# Altium project iMX6 Rex_V1I1.PrjPcb
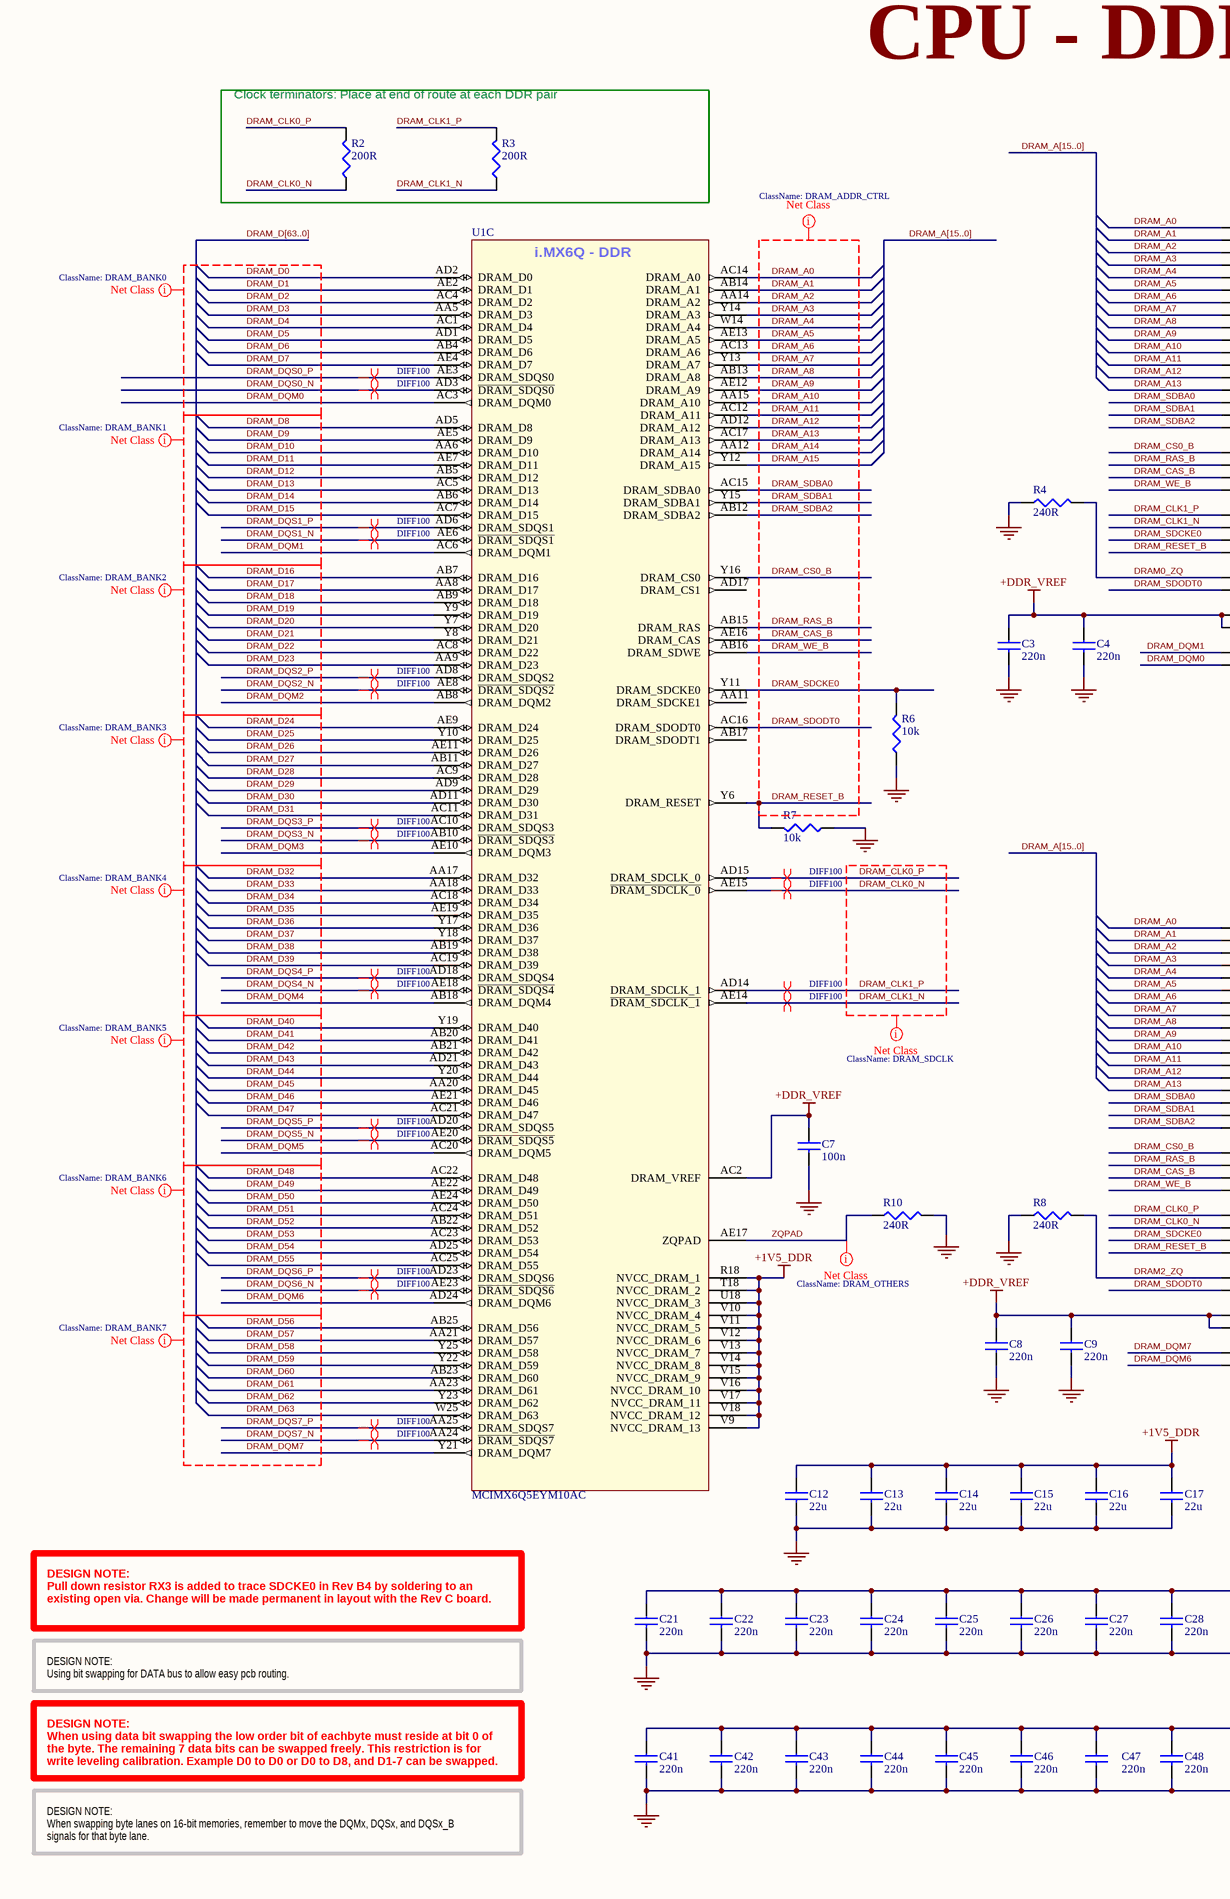
[diagram p0: [04] - CPU - DDR3, DDR3 MEM.SchDoc, left]
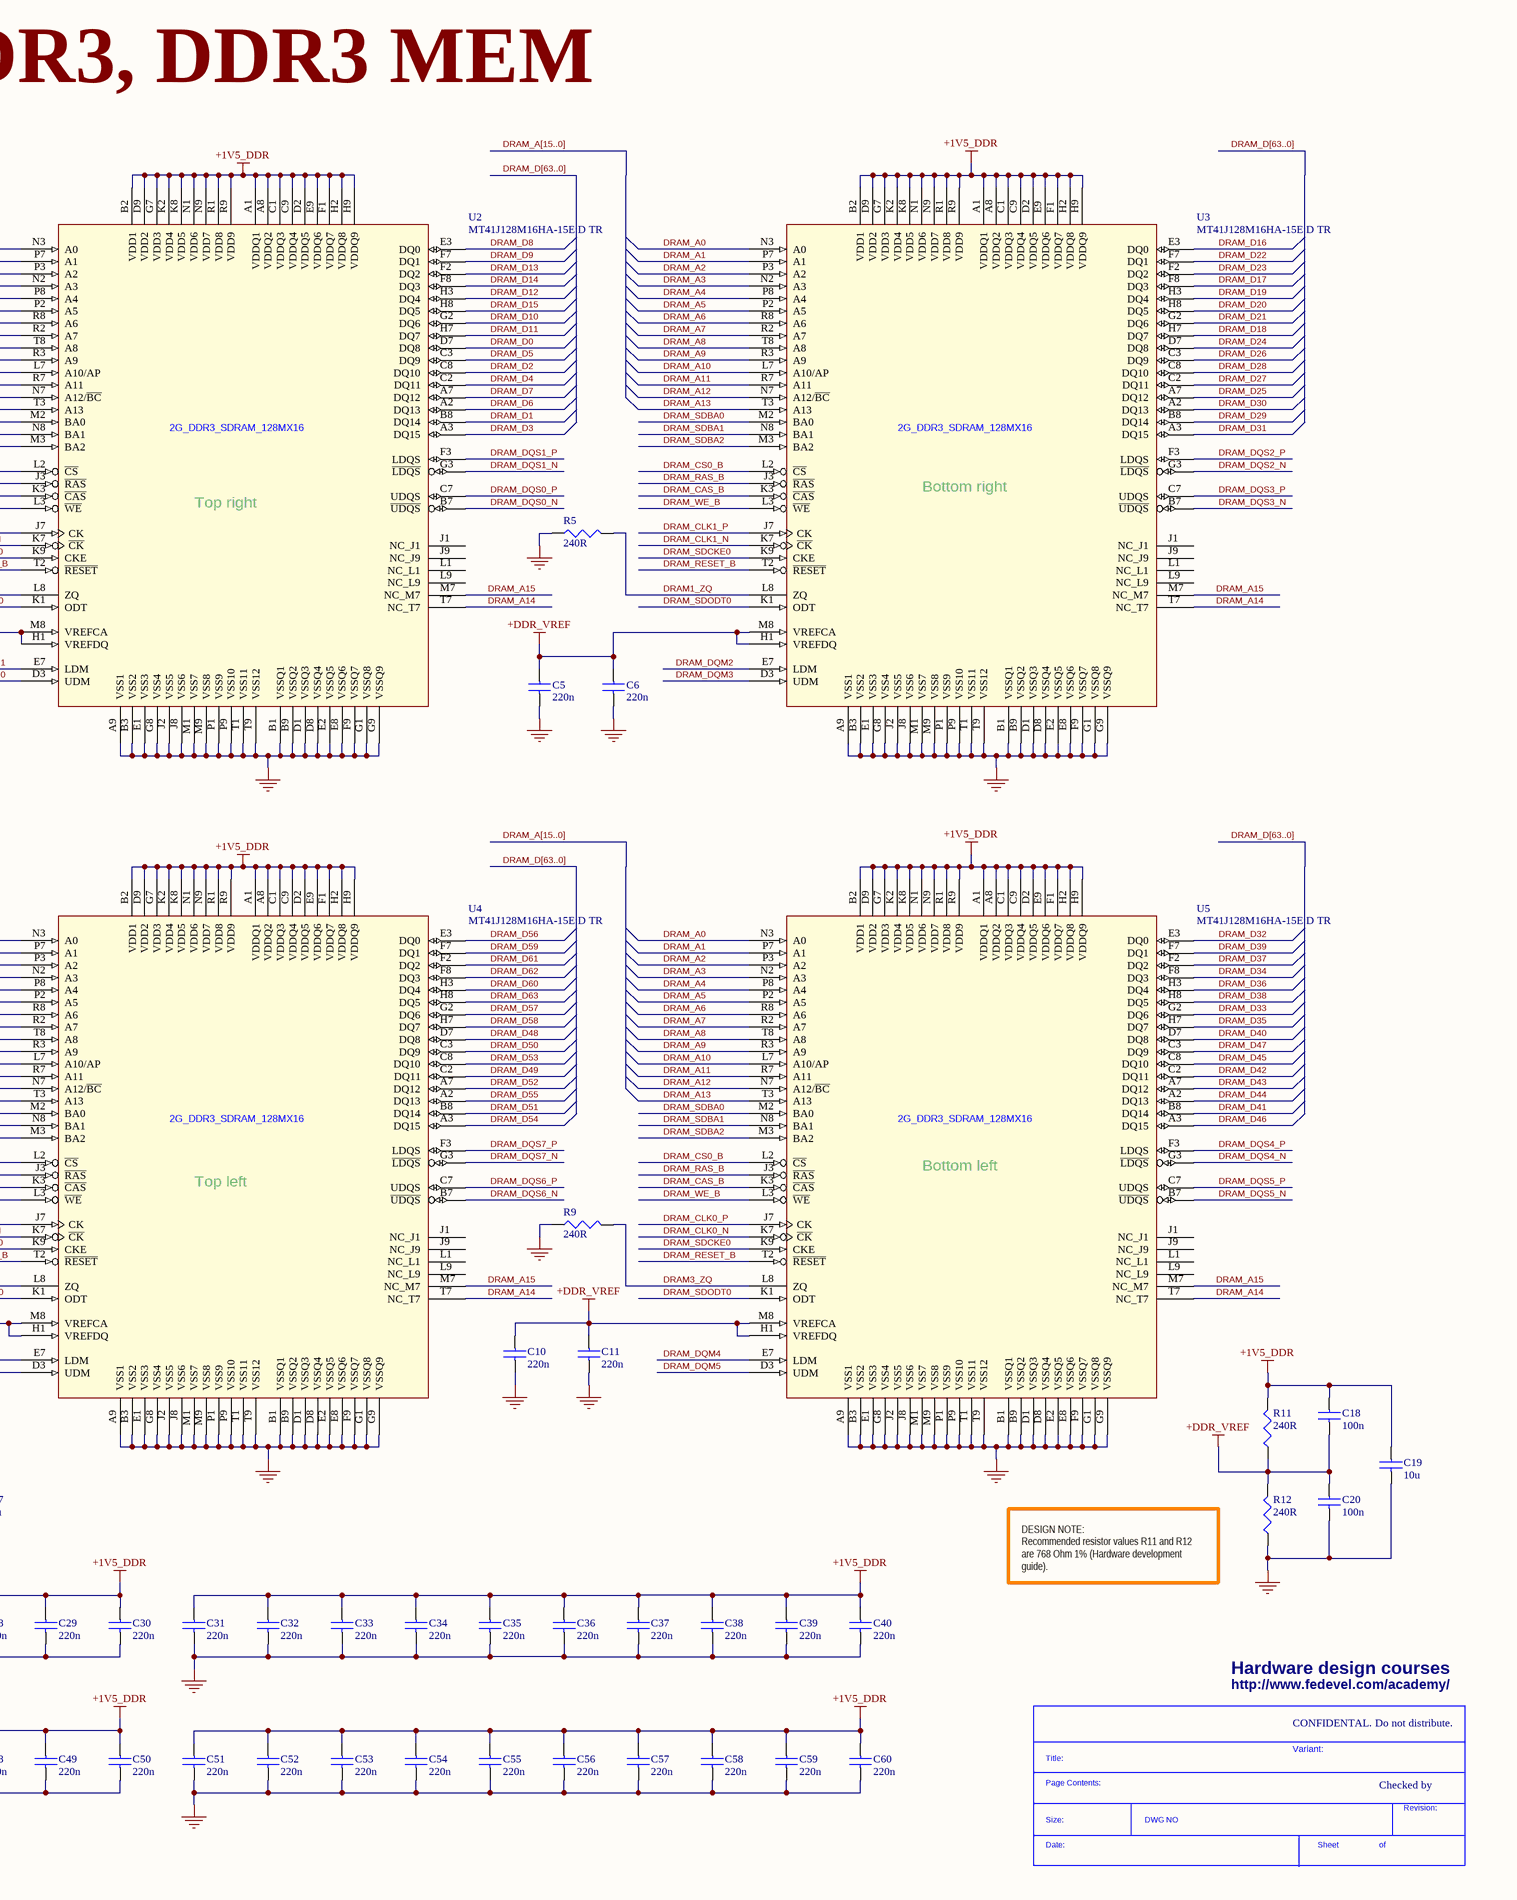
[diagram p1: [04] - CPU - DDR3, DDR3 MEM.SchDoc, right]
ClientCompanyName: FEDEVEL Academy; ClientContactEmail: robert.feranec@fedevel.com; ClientContactName: Robert Feranec; ClientWebsite: http://www.fedevel.com/academy/; Company: (c) 2013 FEDEVEL www.fedevel.com; Project: iMX6 Rex Module; VersionRevision: V1I1
2 sheets, 169 parts. Net scope: global (net labels, ports and power ports of the same name join across sheets).
Board file: iMX6 Rex_V1I1_PCB.PcbDoc
Sheets:
  [04] - CPU - DDR3, DDR3 MEM.SchDoc
  [11] - CPU - POWER.SchDoc

## Sheet [04] - CPU - DDR3, DDR3 MEM.SchDoc
size A2; DocumentNumber: 4; SheetNumber: 4; SheetTotal: 20

### Parts
(Parts that share a designator on the sheet are numbered #1, #2 ... from top to bottom, then left to right.)
*#1  SDTitleBlock  (value not drawn)  (graphical)
C3  220n  [C0402]
C4  220n  [C0402]
C5  220n  [C0402]
C6  220n  [C0402]
C7  100n  [C0402]
C8  220n  [C0402]
C9  220n  [C0402]
C10  220n  [C0402]
C11  220n  [C0402]
C12  22u  [C0603]
C13  22u  [C0603]
C14  22u  [C0603]
C15  22u  [C0603]
C16  22u  [C0603]
C17  22u  [C0603]
C18  100n  [C0402]
C19  10u  [C0603]
C20  100n  [C0402]
C21  220n  [C0402]
C22  220n  [C0402]
C23  220n  [C0402]
C24  220n  [C0402]
C25  220n  [C0402]
C26  220n  [C0402]
C27  220n  [C0402]
C28  220n  [C0402]
C29  220n  [C0402]
C30  220n  [C0402]
C31  220n  [C0402]
C32  220n  [C0402]
C33  220n  [C0402]
C34  220n  [C0402]
C35  220n  [C0402]
C36  220n  [C0402]
C37  220n  [C0402]
C38  220n  [C0402]
C39  220n  [C0402]
C40  220n  [C0402]
C41  220n  [C0402]
C42  220n  [C0402]
C43  220n  [C0402]
C44  220n  [C0402]
C45  220n  [C0402]
C46  220n  [C0402]
C47  220n  [C0402]
C48  220n  [C0402]
C49  220n  [C0402]
C50  220n  [C0402]
C51  220n  [C0402]
C52  220n  [C0402]
C53  220n  [C0402]
C54  220n  [C0402]
C55  220n  [C0402]
C56  220n  [C0402]
C57  220n  [C0402]
C58  220n  [C0402]
C59  220n  [C0402]
C60  220n  [C0402]
R2  200R  [R0402]
R3  200R  [R0402]
R4  240R  [R0402]
R5  240R  [R0402]
R6  10k  [R0402]
R7  10k  [R0402]
R8  240R  [R0402]
R9  240R  [R0402]
R10  240R  [R0402]
R11  240R  [R0402]
R12  240R  [R0402]
U1  MCIMX6Q5EYM10AC  [PBGA624]  (part C of 15)
U2  MT41J128M16HA-15E:D TR  [96_FPGA_DD3]
U3  MT41J128M16HA-15E:D TR  [96_FPGA_DD3]
U4  MT41J128M16HA-15E:D TR  [96_FPGA_DD3]
U5  MT41J128M16HA-15E:D TR  [96_FPGA_DD3]

### Blocks framed on the sheet
Clock terminators: Place at end of route at each DDR pair: R2 R3

### Nets
+1V5_DDR: C12.1 C13.1 C14.1 C15.1 C16.1 C17.1 C18.1 C19.1 C21.1 C22.1 C23.1 C24.1 C25.1 C26.1 C27.1 C28.1 C29.1 C30.1 C31.1 C32.1 C33.1 C34.1 C35.1 C36.1 C37.1 C38.1 C39.1 C40.1 C41.1 C42.1 C43.1 C44.1 C45.1 C46.1 C47.1 C48.1 C49.1 C50.1 C51.1 C52.1 C53.1 C54.1 C55.1 C56.1 C57.1 C58.1 C59.1 C60.1 R11.2 U1.R18(NVCC_DRAM_1) U1.T18(NVCC_DRAM_2) U1.U18(NVCC_DRAM_3) U1.V9(NVCC_DRAM_13) U1.V10(NVCC_DRAM_4) U1.V11(NVCC_DRAM_5) U1.V12(NVCC_DRAM_6) U1.V13(NVCC_DRAM_7) U1.V14(NVCC_DRAM_8) U1.V15(NVCC_DRAM_9) U1.V16(NVCC_DRAM_10) U1.V17(NVCC_DRAM_11) U1.V18(NVCC_DRAM_12) U2.A1(VDDQ1) U2.A8(VDDQ2) U2.B2(VDD1) U2.C1(VDDQ3) U2.C9(VDDQ4) U2.D2(VDDQ5) U2.D9(VDD2) U2.E9(VDDQ6) U2.F1(VDDQ7) U2.G7(VDD3) U2.H2(VDDQ8) U2.H9(VDDQ9) U2.K2(VDD4) U2.K8(VDD5) U2.N1(VDD6) U2.N9(VDD7) U2.R1(VDD8) U2.R9(VDD9) U3.A1(VDDQ1) U3.A8(VDDQ2) U3.B2(VDD1) U3.C1(VDDQ3) U3.C9(VDDQ4) U3.D2(VDDQ5) U3.D9(VDD2) U3.E9(VDDQ6) U3.F1(VDDQ7) U3.G7(VDD3) U3.H2(VDDQ8) U3.H9(VDDQ9) U3.K2(VDD4) U3.K8(VDD5) U3.N1(VDD6) U3.N9(VDD7) U3.R1(VDD8) U3.R9(VDD9) U4.A1(VDDQ1) U4.A8(VDDQ2) U4.B2(VDD1) U4.C1(VDDQ3) U4.C9(VDDQ4) U4.D2(VDDQ5) U4.D9(VDD2) U4.E9(VDDQ6) U4.F1(VDDQ7) U4.G7(VDD3) U4.H2(VDDQ8) U4.H9(VDDQ9) U4.K2(VDD4) U4.K8(VDD5) U4.N1(VDD6) U4.N9(VDD7) U4.R1(VDD8) U4.R9(VDD9) U5.A1(VDDQ1) U5.A8(VDDQ2) U5.B2(VDD1) U5.C1(VDDQ3) U5.C9(VDDQ4) U5.D2(VDDQ5) U5.D9(VDD2) U5.E9(VDDQ6) U5.F1(VDDQ7) U5.G7(VDD3) U5.H2(VDDQ8) U5.H9(VDDQ9) U5.K2(VDD4) U5.K8(VDD5) U5.N1(VDD6) U5.N9(VDD7) U5.R1(VDD8) U5.R9(VDD9)
+DDR_VREF: C3.1 C4.1 C5.1 C6.1 C7.1 C8.1 C9.1 C10.1 C11.1 C18.2 C20.1 R11.1 R12.2 U1.AC2(DRAM_VREF) U2.H1(VREFDQ) U2.M8(VREFCA) U3.H1(VREFDQ) U3.M8(VREFCA) U4.H1(VREFDQ) U4.M8(VREFCA) U5.H1(VREFDQ) U5.M8(VREFCA)
GND: C3.2 C4.2 C5.2 C6.2 C7.2 C8.2 C9.2 C10.2 C11.2 C12.2 C13.2 C14.2 C15.2 C16.2 C17.2 C19.2 C20.2 C21.2 C22.2 C23.2 C24.2 C25.2 C26.2 C27.2 C28.2 C29.2 C30.2 C31.2 C32.2 C33.2 C34.2 C35.2 C36.2 C37.2 C38.2 C39.2 C40.2 C41.2 C42.2 C43.2 C44.2 C45.2 C46.2 C47.2 C48.2 C49.2 C50.2 C51.2 C52.2 C53.2 C54.2 C55.2 C56.2 C57.2 C58.2 C59.2 C60.2 R4.1 R5.1 R6.1 R7.1 R8.1 R9.1 R10.2 R12.1 U2.A9(VSS1) U2.B1(VSSQ1) U2.B3(VSS2) U2.B9(VSSQ2) U2.D1(VSSQ3) U2.D8(VSSQ4) U2.E1(VSS3) U2.E2(VSSQ5) U2.E8(VSSQ6) U2.F9(VSSQ7) U2.G1(VSSQ8) U2.G8(VSS4) U2.G9(VSSQ9) U2.J2(VSS5) U2.J8(VSS6) U2.M1(VSS7) U2.M9(VSS8) U2.P1(VSS9) U2.P9(VSS10) U2.T1(VSS11) U2.T9(VSS12) U3.A9(VSS1) U3.B1(VSSQ1) U3.B3(VSS2) U3.B9(VSSQ2) U3.D1(VSSQ3) U3.D8(VSSQ4) U3.E1(VSS3) U3.E2(VSSQ5) U3.E8(VSSQ6) U3.F9(VSSQ7) U3.G1(VSSQ8) U3.G8(VSS4) U3.G9(VSSQ9) U3.J2(VSS5) U3.J8(VSS6) U3.M1(VSS7) U3.M9(VSS8) U3.P1(VSS9) U3.P9(VSS10) U3.T1(VSS11) U3.T9(VSS12) U4.A9(VSS1) U4.B1(VSSQ1) U4.B3(VSS2) U4.B9(VSSQ2) U4.D1(VSSQ3) U4.D8(VSSQ4) U4.E1(VSS3) U4.E2(VSSQ5) U4.E8(VSSQ6) U4.F9(VSSQ7) U4.G1(VSSQ8) U4.G8(VSS4) U4.G9(VSSQ9) U4.J2(VSS5) U4.J8(VSS6) U4.M1(VSS7) U4.M9(VSS8) U4.P1(VSS9) U4.P9(VSS10) U4.T1(VSS11) U4.T9(VSS12) U5.A9(VSS1) U5.B1(VSSQ1) U5.B3(VSS2) U5.B9(VSSQ2) U5.D1(VSSQ3) U5.D8(VSSQ4) U5.E1(VSS3) U5.E2(VSSQ5) U5.E8(VSSQ6) U5.F9(VSSQ7) U5.G1(VSSQ8) U5.G8(VSS4) U5.G9(VSSQ9) U5.J2(VSS5) U5.J8(VSS6) U5.M1(VSS7) U5.M9(VSS8) U5.P1(VSS9) U5.P9(VSS10) U5.T1(VSS11) U5.T9(VSS12)
DRAM0_ZQ: R4.2 U2.L8(ZQ)
DRAM1_ZQ: R5.2 U3.L8(ZQ)
DRAM2_ZQ: R8.2 U4.L8(ZQ)
DRAM3_ZQ: R9.2 U5.L8(ZQ)
DRAM_A0: U1.AC14(DRAM_A0) U2.N3(A0) U3.N3(A0) U4.N3(A0) U5.N3(A0)
DRAM_A1: U1.AB14(DRAM_A1) U2.P7(A1) U3.P7(A1) U4.P7(A1) U5.P7(A1)
DRAM_A2: U1.AA14(DRAM_A2) U2.P3(A2) U3.P3(A2) U4.P3(A2) U5.P3(A2)
DRAM_A3: U1.Y14(DRAM_A3) U2.N2(A3) U3.N2(A3) U4.N2(A3) U5.N2(A3)
DRAM_A4: U1.W14(DRAM_A4) U2.P8(A4) U3.P8(A4) U4.P8(A4) U5.P8(A4)
DRAM_A5: U1.AE13(DRAM_A5) U2.P2(A5) U3.P2(A5) U4.P2(A5) U5.P2(A5)
DRAM_A6: U1.AC13(DRAM_A6) U2.R8(A6) U3.R8(A6) U4.R8(A6) U5.R8(A6)
DRAM_A7: U1.Y13(DRAM_A7) U2.R2(A7) U3.R2(A7) U4.R2(A7) U5.R2(A7)
DRAM_A8: U1.AB13(DRAM_A8) U2.T8(A8) U3.T8(A8) U4.T8(A8) U5.T8(A8)
DRAM_A9: U1.AE12(DRAM_A9) U2.R3(A9) U3.R3(A9) U4.R3(A9) U5.R3(A9)
DRAM_A10: U1.AA15(DRAM_A10) U2.L7(A10/AP) U3.L7(A10/AP) U4.L7(A10/AP) U5.L7(A10/AP)
DRAM_A11: U1.AC12(DRAM_A11) U2.R7(A11) U3.R7(A11) U4.R7(A11) U5.R7(A11)
DRAM_A12: U1.AD12(DRAM_A12) U2.N7(A12/~{BC}) U3.N7(A12/~{BC}) U4.N7(A12/~{BC}) U5.N7(A12/~{BC})
DRAM_A13: U1.AC17(DRAM_A13) U2.T3(A13) U3.T3(A13) U4.T3(A13) U5.T3(A13)
DRAM_A14: U1.AA12(DRAM_A14) U2.T7(NC_T7) U3.T7(NC_T7) U4.T7(NC_T7) U5.T7(NC_T7)
DRAM_A15: U1.Y12(DRAM_A15) U2.M7(NC_M7) U3.M7(NC_M7) U4.M7(NC_M7) U5.M7(NC_M7)
DRAM_CAS_B: U1.AE16(DRAM_CAS) U2.K3(~{CAS}) U3.K3(~{CAS}) U4.K3(~{CAS}) U5.K3(~{CAS})
DRAM_CLK0_N: R2.1 U1.AE15(~{DRAM_SDCLK_0}) U4.K7(~{CK}) U5.K7(~{CK})
DRAM_CLK0_P: R2.2 U1.AD15(DRAM_SDCLK_0) U4.J7(CK) U5.J7(CK)
DRAM_CLK1_N: R3.1 U1.AE14(~{DRAM_SDCLK_1}) U2.K7(~{CK}) U3.K7(~{CK})
DRAM_CLK1_P: R3.2 U1.AD14(DRAM_SDCLK_1) U2.J7(CK) U3.J7(CK)
DRAM_CS0_B: U1.Y16(DRAM_CS0) U2.L2(~{CS}) U3.L2(~{CS}) U4.L2(~{CS}) U5.L2(~{CS})
DRAM_D0: U1.AD2(DRAM_D0) U2.D7(DQ8)
DRAM_D1: U1.AE2(DRAM_D1) U2.B8(DQ14)
DRAM_D2: U1.AC4(DRAM_D2) U2.C8(DQ10)
DRAM_D3: U1.AA5(DRAM_D3) U2.A3(DQ15)
DRAM_D4: U1.AC1(DRAM_D4) U2.C2(DQ11)
DRAM_D5: U1.AD1(DRAM_D5) U2.C3(DQ9)
DRAM_D6: U1.AB4(DRAM_D6) U2.A2(DQ13)
DRAM_D7: U1.AE4(DRAM_D7) U2.A7(DQ12)
DRAM_D8: U1.AD5(DRAM_D8) U2.E3(DQ0)
DRAM_D9: U1.AE5(DRAM_D9) U2.F7(DQ1)
DRAM_D10: U1.AA6(DRAM_D10) U2.G2(DQ6)
DRAM_D11: U1.AE7(DRAM_D11) U2.H7(DQ7)
DRAM_D12: U1.AB5(DRAM_D12) U2.H3(DQ4)
DRAM_D13: U1.AC5(DRAM_D13) U2.F2(DQ2)
DRAM_D14: U1.AB6(DRAM_D14) U2.F8(DQ3)
DRAM_D15: U1.AC7(DRAM_D15) U2.H8(DQ5)
DRAM_D16: U1.AB7(DRAM_D16) U3.E3(DQ0)
DRAM_D17: U1.AA8(DRAM_D17) U3.F8(DQ3)
DRAM_D18: U1.AB9(DRAM_D18) U3.H7(DQ7)
DRAM_D19: U1.Y9(DRAM_D19) U3.H3(DQ4)
DRAM_D20: U1.Y7(DRAM_D20) U3.H8(DQ5)
DRAM_D21: U1.Y8(DRAM_D21) U3.G2(DQ6)
DRAM_D22: U1.AC8(DRAM_D22) U3.F7(DQ1)
DRAM_D23: U1.AA9(DRAM_D23) U3.F2(DQ2)
DRAM_D24: U1.AE9(DRAM_D24) U3.D7(DQ8)
DRAM_D25: U1.Y10(DRAM_D25) U3.A7(DQ12)
DRAM_D26: U1.AE11(DRAM_D26) U3.C3(DQ9)
DRAM_D27: U1.AB11(DRAM_D27) U3.C2(DQ11)
DRAM_D28: U1.AC9(DRAM_D28) U3.C8(DQ10)
DRAM_D29: U1.AD9(DRAM_D29) U3.B8(DQ14)
DRAM_D30: U1.AD11(DRAM_D30) U3.A2(DQ13)
DRAM_D31: U1.AC11(DRAM_D31) U3.A3(DQ15)
DRAM_D32: U1.AA17(DRAM_D32) U5.E3(DQ0)
DRAM_D33: U1.AA18(DRAM_D33) U5.G2(DQ6)
DRAM_D34: U1.AC18(DRAM_D34) U5.F8(DQ3)
DRAM_D35: U1.AE19(DRAM_D35) U5.H7(DQ7)
DRAM_D36: U1.Y17(DRAM_D36) U5.H3(DQ4)
DRAM_D37: U1.Y18(DRAM_D37) U5.F2(DQ2)
DRAM_D38: U1.AB19(DRAM_D38) U5.H8(DQ5)
DRAM_D39: U1.AC19(DRAM_D39) U5.F7(DQ1)
DRAM_D40: U1.Y19(DRAM_D40) U5.D7(DQ8)
DRAM_D41: U1.AB20(DRAM_D41) U5.B8(DQ14)
DRAM_D42: U1.AB21(DRAM_D42) U5.C2(DQ11)
DRAM_D43: U1.AD21(DRAM_D43) U5.A7(DQ12)
DRAM_D44: U1.Y20(DRAM_D44) U5.A2(DQ13)
DRAM_D45: U1.AA20(DRAM_D45) U5.C8(DQ10)
DRAM_D46: U1.AE21(DRAM_D46) U5.A3(DQ15)
DRAM_D47: U1.AC21(DRAM_D47) U5.C3(DQ9)
DRAM_D48: U1.AC22(DRAM_D48) U4.D7(DQ8)
DRAM_D49: U1.AE22(DRAM_D49) U4.C2(DQ11)
DRAM_D50: U1.AE24(DRAM_D50) U4.C3(DQ9)
DRAM_D51: U1.AC24(DRAM_D51) U4.B8(DQ14)
DRAM_D52: U1.AB22(DRAM_D52) U4.A7(DQ12)
DRAM_D53: U1.AC23(DRAM_D53) U4.C8(DQ10)
DRAM_D54: U1.AD25(DRAM_D54) U4.A3(DQ15)
DRAM_D55: U1.AC25(DRAM_D55) U4.A2(DQ13)
DRAM_D56: U1.AB25(DRAM_D56) U4.E3(DQ0)
DRAM_D57: U1.AA21(DRAM_D57) U4.G2(DQ6)
DRAM_D58: U1.Y25(DRAM_D58) U4.H7(DQ7)
DRAM_D59: U1.Y22(DRAM_D59) U4.F7(DQ1)
DRAM_D60: U1.AB23(DRAM_D60) U4.H3(DQ4)
DRAM_D61: U1.AA23(DRAM_D61) U4.F2(DQ2)
DRAM_D62: U1.Y23(DRAM_D62) U4.F8(DQ3)
DRAM_D63: U1.W25(DRAM_D63) U4.H8(DQ5)
DRAM_DQM0: U1.AC3(DRAM_DQM0) U2.D3(UDM)
DRAM_DQM1: U1.AC6(DRAM_DQM1) U2.E7(LDM)
DRAM_DQM2: U1.AB8(DRAM_DQM2) U3.E7(LDM)
DRAM_DQM3: U1.AE10(DRAM_DQM3) U3.D3(UDM)
DRAM_DQM4: U1.AB18(DRAM_DQM4) U5.E7(LDM)
DRAM_DQM5: U1.AC20(DRAM_DQM5) U5.D3(UDM)
DRAM_DQM6: U1.AD24(DRAM_DQM6) U4.D3(UDM)
DRAM_DQM7: U1.Y21(DRAM_DQM7) U4.E7(LDM)
DRAM_DQS0_N: U1.AD3(~{DRAM_SDQS0}) U2.B7(~{UDQS})
DRAM_DQS0_P: U1.AE3(DRAM_SDQS0) U2.C7(UDQS)
DRAM_DQS1_N: U1.AE6(~{DRAM_SDQS1}) U2.G3(~{LDQS})
DRAM_DQS1_P: U1.AD6(DRAM_SDQS1) U2.F3(LDQS)
DRAM_DQS2_N: U1.AE8(~{DRAM_SDQS2}) U3.G3(~{LDQS})
DRAM_DQS2_P: U1.AD8(DRAM_SDQS2) U3.F3(LDQS)
DRAM_DQS3_N: U1.AB10(~{DRAM_SDQS3}) U3.B7(~{UDQS})
DRAM_DQS3_P: U1.AC10(DRAM_SDQS3) U3.C7(UDQS)
DRAM_DQS4_N: U1.AE18(~{DRAM_SDQS4}) U5.G3(~{LDQS})
DRAM_DQS4_P: U1.AD18(DRAM_SDQS4) U5.F3(LDQS)
DRAM_DQS5_N: U1.AE20(~{DRAM_SDQS5}) U5.B7(~{UDQS})
DRAM_DQS5_P: U1.AD20(DRAM_SDQS5) U5.C7(UDQS)
DRAM_DQS6_N: U1.AE23(~{DRAM_SDQS6}) U4.B7(~{UDQS})
DRAM_DQS6_P: U1.AD23(DRAM_SDQS6) U4.C7(UDQS)
DRAM_DQS7_N: U1.AA24(~{DRAM_SDQS7}) U4.G3(~{LDQS})
DRAM_DQS7_P: U1.AA25(DRAM_SDQS7) U4.F3(LDQS)
DRAM_RAS_B: U1.AB15(DRAM_RAS) U2.J3(~{RAS}) U3.J3(~{RAS}) U4.J3(~{RAS}) U5.J3(~{RAS})
DRAM_RESET_B: R7.2 U1.Y6(DRAM_RESET) U2.T2(~{RESET}) U3.T2(~{RESET}) U4.T2(~{RESET}) U5.T2(~{RESET})
DRAM_SDBA0: U1.AC15(DRAM_SDBA0) U2.M2(BA0) U3.M2(BA0) U4.M2(BA0) U5.M2(BA0)
DRAM_SDBA1: U1.Y15(DRAM_SDBA1) U2.N8(BA1) U3.N8(BA1) U4.N8(BA1) U5.N8(BA1)
DRAM_SDBA2: U1.AB12(DRAM_SDBA2) U2.M3(BA2) U3.M3(BA2) U4.M3(BA2) U5.M3(BA2)
DRAM_SDCKE0: R6.2 U1.Y11(DRAM_SDCKE0) U2.K9(CKE) U3.K9(CKE) U4.K9(CKE) U5.K9(CKE)
DRAM_SDODT0: U1.AC16(DRAM_SDODT0) U2.K1(ODT) U3.K1(ODT) U4.K1(ODT) U5.K1(ODT)
DRAM_WE_B: U1.AB16(DRAM_SDWE) U2.L3(~{WE}) U3.L3(~{WE}) U4.L3(~{WE}) U5.L3(~{WE})
ZQPAD: R10.1 U1.AE17(ZQPAD)

Not connected (* = marked no-connect by the designer): U1 AA11(DRAM_SDCKE1) AB17(DRAM_SDODT1) AD17(DRAM_CS1); U2 J1(NC_J1) J9(NC_J9) L1(NC_L1) L9(NC_L9); U3 J1(NC_J1) J9(NC_J9) L1(NC_L1) L9(NC_L9); U4 J1(NC_J1) J9(NC_J9) L1(NC_L1) L9(NC_L9); U5 J1(NC_J1) J9(NC_J9) L1(NC_L1) L9(NC_L9)

### Buses and harness runs
bus DRAM_A[15..0]
bus DRAM_D[63..0]

### Layout directives
net class DRAM_BANK0: DRAM_D0, DRAM_D1, DRAM_D2, DRAM_D3, DRAM_D4, DRAM_D5, DRAM_D6, DRAM_D7, DRAM_DQM0, DRAM_DQS0_N, DRAM_DQS0_P
net class DRAM_BANK1: DRAM_D8, DRAM_D9, DRAM_D10, DRAM_D11, DRAM_D12, DRAM_D13, DRAM_D14, DRAM_D15, DRAM_DQM1, DRAM_DQS1_N, DRAM_DQS1_P
net class DRAM_BANK2: DRAM_D16, DRAM_D17, DRAM_D18, DRAM_D19, DRAM_D20, DRAM_D21, DRAM_D22, DRAM_D23, DRAM_DQM2, DRAM_DQS2_N, DRAM_DQS2_P
net class DRAM_BANK3: DRAM_D24, DRAM_D25, DRAM_D26, DRAM_D27, DRAM_D28, DRAM_D29, DRAM_D30, DRAM_D31, DRAM_DQM3, DRAM_DQS3_N, DRAM_DQS3_P
net class DRAM_BANK4: DRAM_D32, DRAM_D33, DRAM_D34, DRAM_D35, DRAM_D36, DRAM_D37, DRAM_D38, DRAM_D39, DRAM_DQM4, DRAM_DQS4_N, DRAM_DQS4_P
net class DRAM_BANK5: DRAM_D40, DRAM_D41, DRAM_D42, DRAM_D43, DRAM_D44, DRAM_D45, DRAM_D46, DRAM_D47, DRAM_DQM5, DRAM_DQS5_N, DRAM_DQS5_P
net class DRAM_BANK6: DRAM_D48, DRAM_D49, DRAM_D50, DRAM_D51, DRAM_D52, DRAM_D53, DRAM_D54, DRAM_D55, DRAM_DQM6, DRAM_DQS6_N, DRAM_DQS6_P
net class DRAM_BANK7: DRAM_D56, DRAM_D57, DRAM_D58, DRAM_D59, DRAM_D60, DRAM_D61, DRAM_D62, DRAM_D63, DRAM_DQM7, DRAM_DQS7_N, DRAM_DQS7_P
differential pair; net class DIFF100: DRAM_CLK0_N, DRAM_CLK0_P, DRAM_CLK1_N, DRAM_CLK1_P, DRAM_DQS0_N, DRAM_DQS0_P, DRAM_DQS1_N, DRAM_DQS1_P, DRAM_DQS2_N, DRAM_DQS2_P, DRAM_DQS3_N, DRAM_DQS3_P, DRAM_DQS4_N, DRAM_DQS4_P, DRAM_DQS5_N, DRAM_DQS5_P, DRAM_DQS6_N, DRAM_DQS6_P, DRAM_DQS7_N, DRAM_DQS7_P
net class DRAM_ADDR_CTRL: DRAM_A0, DRAM_A1, DRAM_A2, DRAM_A3, DRAM_A4, DRAM_A5, DRAM_A6, DRAM_A7, DRAM_A8, DRAM_A9, DRAM_A10, DRAM_A11, DRAM_A12, DRAM_A13, DRAM_A14, DRAM_A15, DRAM_CAS_B, DRAM_CS0_B, DRAM_RAS_B, DRAM_RESET_B, DRAM_SDBA0, DRAM_SDBA1, DRAM_SDBA2, DRAM_SDCKE0, DRAM_SDODT0, DRAM_WE_B
net class DRAM_SDCLK: DRAM_CLK0_N, DRAM_CLK0_P, DRAM_CLK1_N, DRAM_CLK1_P
net class DRAM_OTHERS: ZQPAD

### Notes on the sheet
- CPU - DDR3, DDR3 MEM
- (near U2) Top right
- (near U3) Bottom right
- (near U4) Top left
- (near U5) Bottom left
- DESIGN NOTE:
  Pull down resistor RX3 is added to trace SDCKE0 in Rev B4 by soldering to an existing open via. Change will be made permanent in layout with the Rev C board.
- DESIGN NOTE:
  Recommended resistor values R11 and R12 are 768 Ohm 1% (Hardware development guide).
- Hardware design courses
- DESIGN NOTE:
  Using bit swapping for DATA bus to allow easy pcb routing.
- http://www.fedevel.com/academy/
- CONFIDENTAL. Do not distribute.
- DESIGN NOTE:
  When using data bit swapping the low order bit of eachbyte must reside at bit 0 of the byte. The remaining 7 data bits can be swapped freely. This restriction is for write leveling calibration. Example D0 to D0 or D0 to D8, and D1-7 can be swapped.
- Variant:
- Checked by
- DESIGN NOTE:
  When swapping byte lanes on 16-bit memories, remember to move the DQMx, DQSx, and DQSx_B signals for that byte lane.
- (in symbol MCIMX6Q5EYM10AC, part C) i.MX6Q - DDR
- (in symbol MT41J128M16HA-15E:D TR) 2G_DDR3_SDRAM_128MX16
- (in symbol SDTitleBlock) Title:; Page Contents:; Revision:; Size:; DWG NO; Date:; Sheet; of

### Library data of the parts
C3-C6 C8-C11 C21-C60 = C1005X5R1E224M: CAP CER .22UF 25V X5R 20% 0402; Manufacturer: TDK Corporation; Capacitance: 0.22µF; Value: 220nF; .Checked PCB: used; Category: Capacitors; Supplier Part Number: 445-5945-1-ND; Manufacturer Part Number: C1005X5R1E224M; Operating Temperature: -55°C ~ 85°C; Package / Case: 0402 (1005 Metric); Price 1k [$]: 0.02600; .Checked SCH: used; Voltage - Rated: 25V; Supplier: Digikey; Supplier 1: Digi-Key; Supplier Part Number 1: 445-5945-1-ND; RoHS: RoHS Compliant; Stock 1: 54593; Pricing 1: 1=0.3, 10=0.2, 100=0.08, 250=0.05752, 500=0.041, 1000=0.03 (USD); Tolerance: ±20%; Temperature Coefficient: X5R; Mounting Type: Surface Mount, MLCC; Applications: General Purpose; Ratings: -; Size / Dimension: 0.039" L x 0.020" W (1.00mm x 0.50mm); Height - Seated (Max): -; Thickness (Max): 0.022" (0.55mm); Lead Spacing: -; Features: -; Packaging: Cut Tape (CT); Lead Style: -; ComponentLink1URL: http://www.tdk.co.jp/tefe02/e412_c.pdf; ComponentLink1Description: http://www.tdk.co.jp/tefe02/e412_c.pdf
C7 C18 C20 = C1005X5R1H104K: CAP CER .10UF 50V X5R 10% 0402; Manufacturer: TDK Corporation; Capacitance: 0.1µF; Value: 100nF; .Checked PCB: used; Category: Capacitors; Supplier Part Number: 445-5942-1-ND; Manufacturer Part Number: C1005X5R1H104K; Operating Temperature: -55°C ~ 85°C; Package / Case: 0402 (1005 Metric); Price 1k [$]: 0.02340; .Checked SCH: used; Voltage - Rated: 50V; Supplier: Digikey; Supplier 1: Digi-Key; Supplier Part Number 1: 445-5942-1-ND; RoHS: RoHS Compliant; Stock 1: 106926; Pricing 1: 1=0.27, 10=0.18, 100=0.072, 250=0.05176, 500=0.0369, 1000=0.027 (USD); Tolerance: ±10%; Temperature Coefficient: X5R; Mounting Type: Surface Mount, MLCC; Applications: General Purpose; Ratings: -; Size / Dimension: 0.039" L x 0.020" W (1.00mm x 0.50mm); Height - Seated (Max): -; Thickness (Max): 0.022" (0.55mm); Lead Spacing: -; Features: -; Packaging: Cut Tape (CT); Lead Style: -; ComponentLink1URL: http://www.tdk.co.jp/tefe02/e412_c.pdf; ComponentLink1Description: http://www.tdk.co.jp/tefe02/e412_c.pdf
C12-C17 = GRM188R60G226MEA0L: CAP CER 22UF 4V 20% X5R 0603; Manufacturer: Murata Electronics North America; Capacitance: 22µF; .Checked PCB: RF, used by MM; .Checked SCH: MM, checked by RF; .Creator: MM; Supplier 1: Digi-Key; Supplier Part Number 1: 490-5526-1-ND; Manufacturer Part Number: GRM188R60G226MEA0L; RoHS: RoHS Compliant; Category: Capacitors; Stock 1: 5760; Pricing 1: 1=0.79, 10=0.663, 50=0.4752, 100=0.4158, 250=0.32672, 500=0.297, 1000=0.2376 (USD); Voltage - Rated: 4V; Tolerance: ±20%; Temperature Coefficient: X5R; Mounting Type: Surface Mount, MLCC; Operating Temperature: -55°C ~ 85°C; Applications: General Purpose; Ratings: -; Package / Case: 0603 (1608 Metric); Size / Dimension: 0.063" L x 0.031" W (1.60mm x 0.80mm); Height - Seated (Max): -; Thickness (Max): 0.035" (0.90mm); Lead Spacing: -; Features: -; Packaging: Cut Tape (CT); Lead Style: -; ComponentLink1URL: http://www.murata.com/products/catalog/pdf/c02e.pdf; ComponentLink1Description: http://www.murata.com/products/catalog/pdf/c02e.pdf
C19 = C1608X5R0J106M: CAP CER 10UF 6.3V X5R 20% 0603; Manufacturer: TDK Corporation; Capacitance: 10µF; Value: 10µF; .Checked PCB: used; Category: Capacitors; Supplier Part Number: 445-4112-1-ND; Manufacturer Part Number: C1608X5R0J106M; Operating Temperature: -55°C ~ 85°C; Package / Case: 0603 (1608 Metric); Price 1k [$]: 0.08580; .Checked SCH: used; Voltage - Rated: 6.3V; Features: Low ESR; Supplier: Digikey; Supplier 1: Digi-Key; Supplier Part Number 1: 445-4112-1-ND; RoHS: RoHS Compliant; Stock 1: 48157; Pricing 1: 1=0.46, 10=0.363, 100=0.1898, 250=0.14024, 500=0.1089, 1000=0.0858 (USD); Tolerance: ±20%; Temperature Coefficient: X5R; Mounting Type: Surface Mount, MLCC; Applications: General Purpose; Ratings: -; Size / Dimension: 0.063" L x 0.031" W (1.60mm x 0.80mm); Height - Seated (Max): -; Thickness (Max): 0.037" (0.95mm); Lead Spacing: -; Packaging: Cut Tape (CT); Lead Style: -; ComponentLink1URL: http://www.tdk.com/pdf/general_B11.pdf; ComponentLink1Description: http://www.tdk.com/pdf/general_B11.pdf
R2 R3 = CRCW0402200RFKED: RES 200 OHM 1/16W 1% 0402 SMD; Manufacturer: Vishay Dale; Resistance (Ohms): 200; Power (Watts): 0.063W, 1/16W; Temperature Coefficient: ±100ppm/°C; .Checked PCB: RF, used by MM; .Checked SCH: MM, checked by RF; .Creator: MM; Supplier 1: Digi-Key; Manufacturer Part Number: CRCW0402200RFKED; RoHS: RoHS Compliant; Category: Resistors; Stock 1: 251574; Pricing 1: 10=0.083, 50=0.0444, 200=0.0255, 1000=0.0174 (USD); Composition: Thick Film; Features: Automotive AEC-Q200 Qualified; Tolerance: ±1%; Package / Case: 0402 (1005 Metric); Supplier Device Package: 0402 (1005 Metric); Size / Dimension: 0.039" L x 0.020" W (1.00mm x 0.50mm); Height: 0.016" (0.40mm); Number of Terminations: 2; Packaging: Cut Tape (CT); ComponentLink1URL: http://www.vishay.com/doc?20035; ComponentLink1Description: http://www.vishay.com/doc?20035; Supplier Part Number 1: 541-200LCT-ND
R4 R5 R8-R12 = RMCF0402FT240R: RES TF 240 OHM 1% 0.0625W 0402; Manufacturer: Stackpole Electronics Inc; Resistance (Ohms): 240; Power (Watts): 0.063W, 1/16W; .Checked PCB: used; Temperature Coefficient: ±100ppm/°C; Category: Resistors; Supplier Part Number: RMCF0402FT240RCT-ND; Manufacturer Part Number: RMCF0402FT240R; Package / Case: 0402 (1005 Metric); Price 1k [$]: 0.00384; Tolerance: ±1%; Value: 240R; .Checked SCH: used; Supplier: Digikey; Supplier 1: Digi-Key; Supplier Part Number 1: RMCF0402FT240RCT-ND; RoHS: RoHS Compliant; Stock 1: 39860; Pricing 1: 1=0.04, 10=0.025, 50=0.0138, 100=0.0105, 250=0.0078, 500=0.00576, 1000=0.00384 (USD); Composition: Thick Film; Features: -; Size / Dimension: 0.039" L x 0.020" W (1.00mm x 0.50mm); Height: 0.016" (0.40mm); Number of Terminations: 2; Packaging: Cut Tape (CT); ComponentLink1URL: http://www.seielect.com/Catalog/SEI-RMCF.pdf; ComponentLink1Description: http://www.seielect.com/Catalog/SEI-RMCF.pdf
R6 R7 = RC0402FR-0710KL: RES 10.0K OHM 1/16W 1% 0402 SMD; Manufacturer: Yageo; Power (Watts): 0.063W, 1/16W; .Checked PCB: used; Temperature Coefficient: ±100ppm/°C; Category: Resistors; Supplier Part Number: 311-10.0KLRCT-ND; Manufacturer Part Number: RC0402FR-0710KL; Package / Case: 0402 (1005 Metric); Price 1k [$]: 0.01421; Resistance (Ohms): 10K; Tolerance: ±1%; Value: 10k; .Checked SCH: used; Supplier: Digikey; Supplier 1: Digi-Key; Supplier Part Number 1: 311-10.0KLRCT-ND; RoHS: RoHS Compliant; Stock 1: 2916495; Pricing 1: 10=0.014, 50=0.0104, 100=0.0079, 250=0.00584, 500=0.00432, 1000=0.00288 (USD); Composition: Thick Film; Features: -; Size / Dimension: 0.039" L x 0.020" W (1.00mm x 0.50mm); Height: 0.016" (0.40mm); Number of Terminations: 2; Packaging: Cut Tape (CT); ComponentLink1URL: http://www.yageo.com/documents/recent/PYu-RC0402_51_RoHS_L_6.pdf; ComponentLink1Description: http://www.yageo.com/documents/recent/PYu-RC0402_51_RoHS_L_6.pdf
U1 = MCIMX6Q5EYM10AC: IC MCU 32BIT ARM QUAD 624FCBGA; Manufacturer: Freescale Semiconductor; Core Processor: ARM® Cortex™-A9; Core Size: 32-Bit Quad-Core; Speed: 1.0GHz; Connectivity: CAN, EBI/EMI, ESAI, Ethernet, GPMI, I2C, MMC/SD, PCI, SATA, SPI, UART, USB, USB OTG; Peripherals: DMA, HDMI, I2S/SSI/AC97, MIPI CSI, MIMI DSI, MIPI HIS, PWM, WDT; Number of I /O: 224; Program Memory Type: External Program Memory; RAM Size: 256K x 8; Voltage - Supply (Vcc/Vdd): 0.925 V ~ 1.5 V; Oscillator Type: Internal; .Creator: MM; .Checked PCB: MM, checked by RF; Supplier 1: Digi-Key; Manufacturer Part Number: MCIMX6Q5EYM10AC; RoHS: RoHS Compliant; Category: Integrated Circuits (ICs); Stock 1: 0; Pricing 1: 1=54.98, 10=51.922, 25=48.868, 100=30.5424 (USD); Program Memory Size: -; EEPROM Size: -; Data Converters: -; Operating Temperature: -20°C ~ 105°C; Package / Case: 624-FBGA, FCBGA; Packaging: Tray; ComponentLink1URL: http://cache.freescale.com/files/32bit/doc/data_sheet/IMX6DQCEC.pdf; ComponentLink1Description: http://cache.freescale.com/files/32bit/doc/data_sheet/IMX6DQCEC.pdf; Supplier Part Number 1: MCIMX6Q5EYM10AC-ND; .Checked SCH: MM
U2-U5 = MT41J128M16HA-15E:D TR: IC DDR3 SDRAM 2GBIT 667MHZ 96BGA; Manufacturer: Micron Technology Inc; Format - Memory: RAM; Memory Size: 2G (128M x 16); Interface: Parallel; Voltage - Supply: 1.425 V ~ 1.575 V; .Creator: MM; .Checked PCB: RF, used by MM; .Checked SCH: MM, checked by RF; Supplier 1: Digi-Key; Manufacturer Part Number: MT41J128M16HA-15E:D TR; RoHS: RoHS Compliant; Category: Integrated Circuits (ICs); Stock 1: 9228; Pricing 1: 1=11.4, 10=10.557, 25=10.3172, 50=10.26, 100=9.0354, 250=8.58332, 500=8.49746 (USD); Memory Type: DDR3 SDRAM; Speed: 667MHz; Operating Temperature: 0°C ~ 95°C; Package / Case: 96-TFBGA; Supplier Device Package: 96-FBGA (9x14); Packaging: Cut Tape (CT); ComponentLink1URL: http://www.micron.com/~/media/Documents/Products/Data%20Sheet/DRAM/2Gb_DDR3_SDRAM.pdf; ComponentLink1Description: http://www.micron.com/~/media/Documents/Products/Data%20Sheet/DRAM/2Gb_DDR3_SDRAM.pdf; Supplier Part Number 1: 557-1493-1-ND

## Sheet [11] - CPU - POWER.SchDoc
size A2; DocumentNumber: 11; SheetNumber: 11; SheetTotal: 20
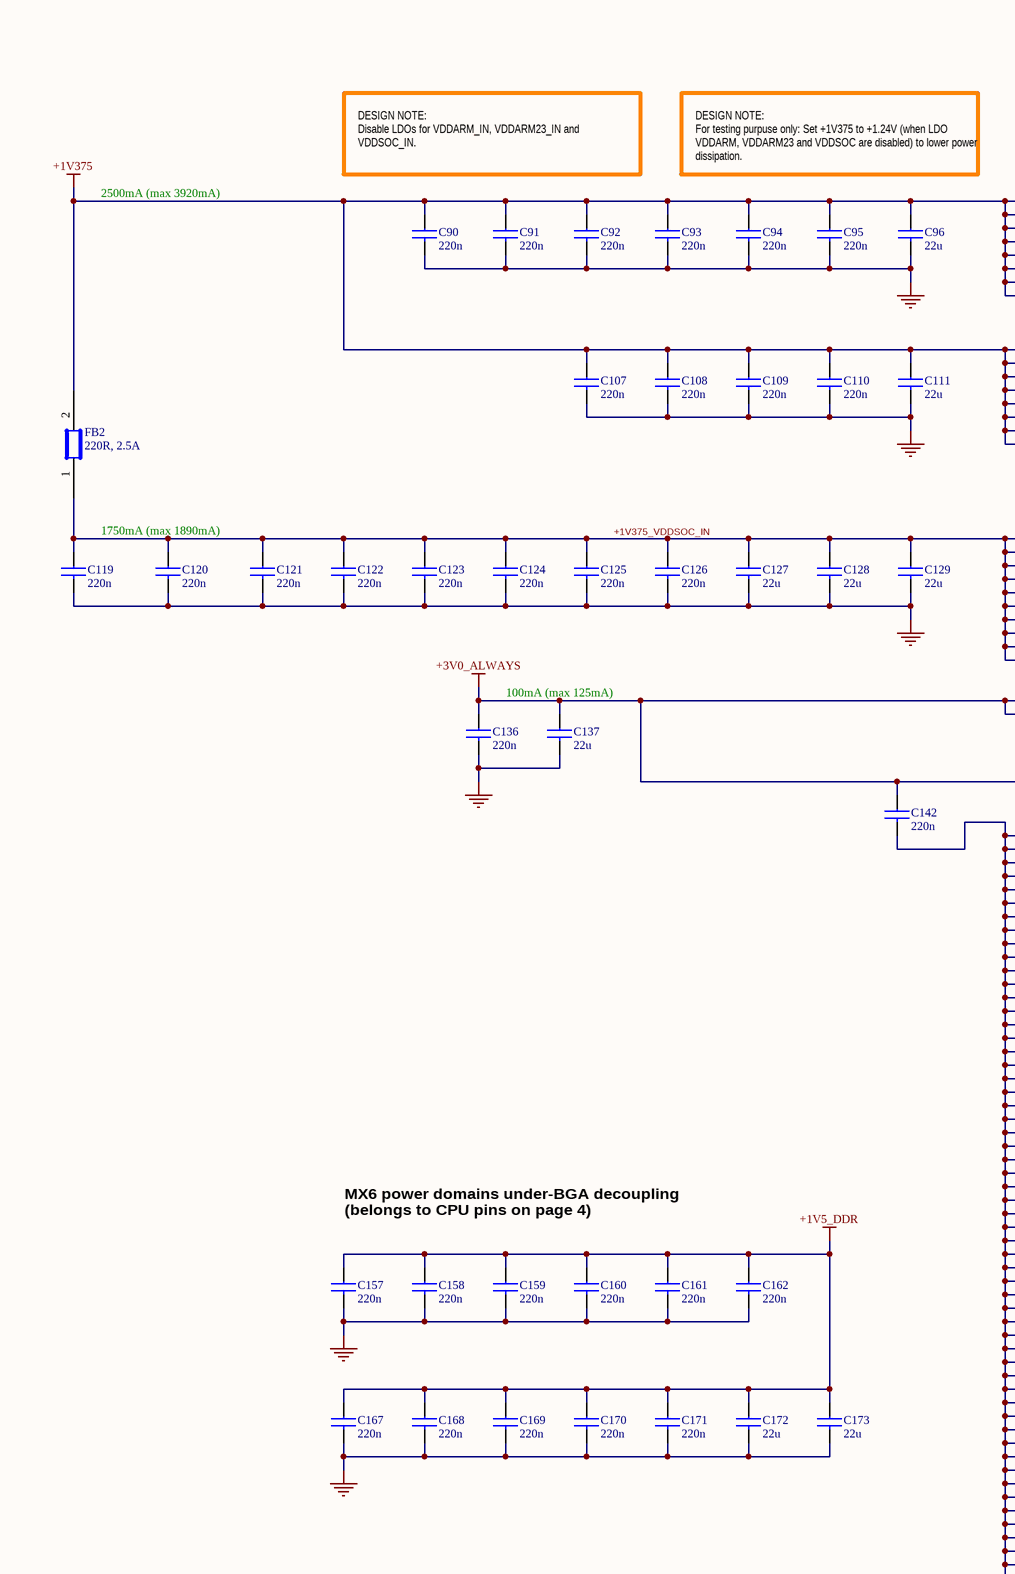
[diagram p2: [11] - CPU - POWER.SchDoc, left]
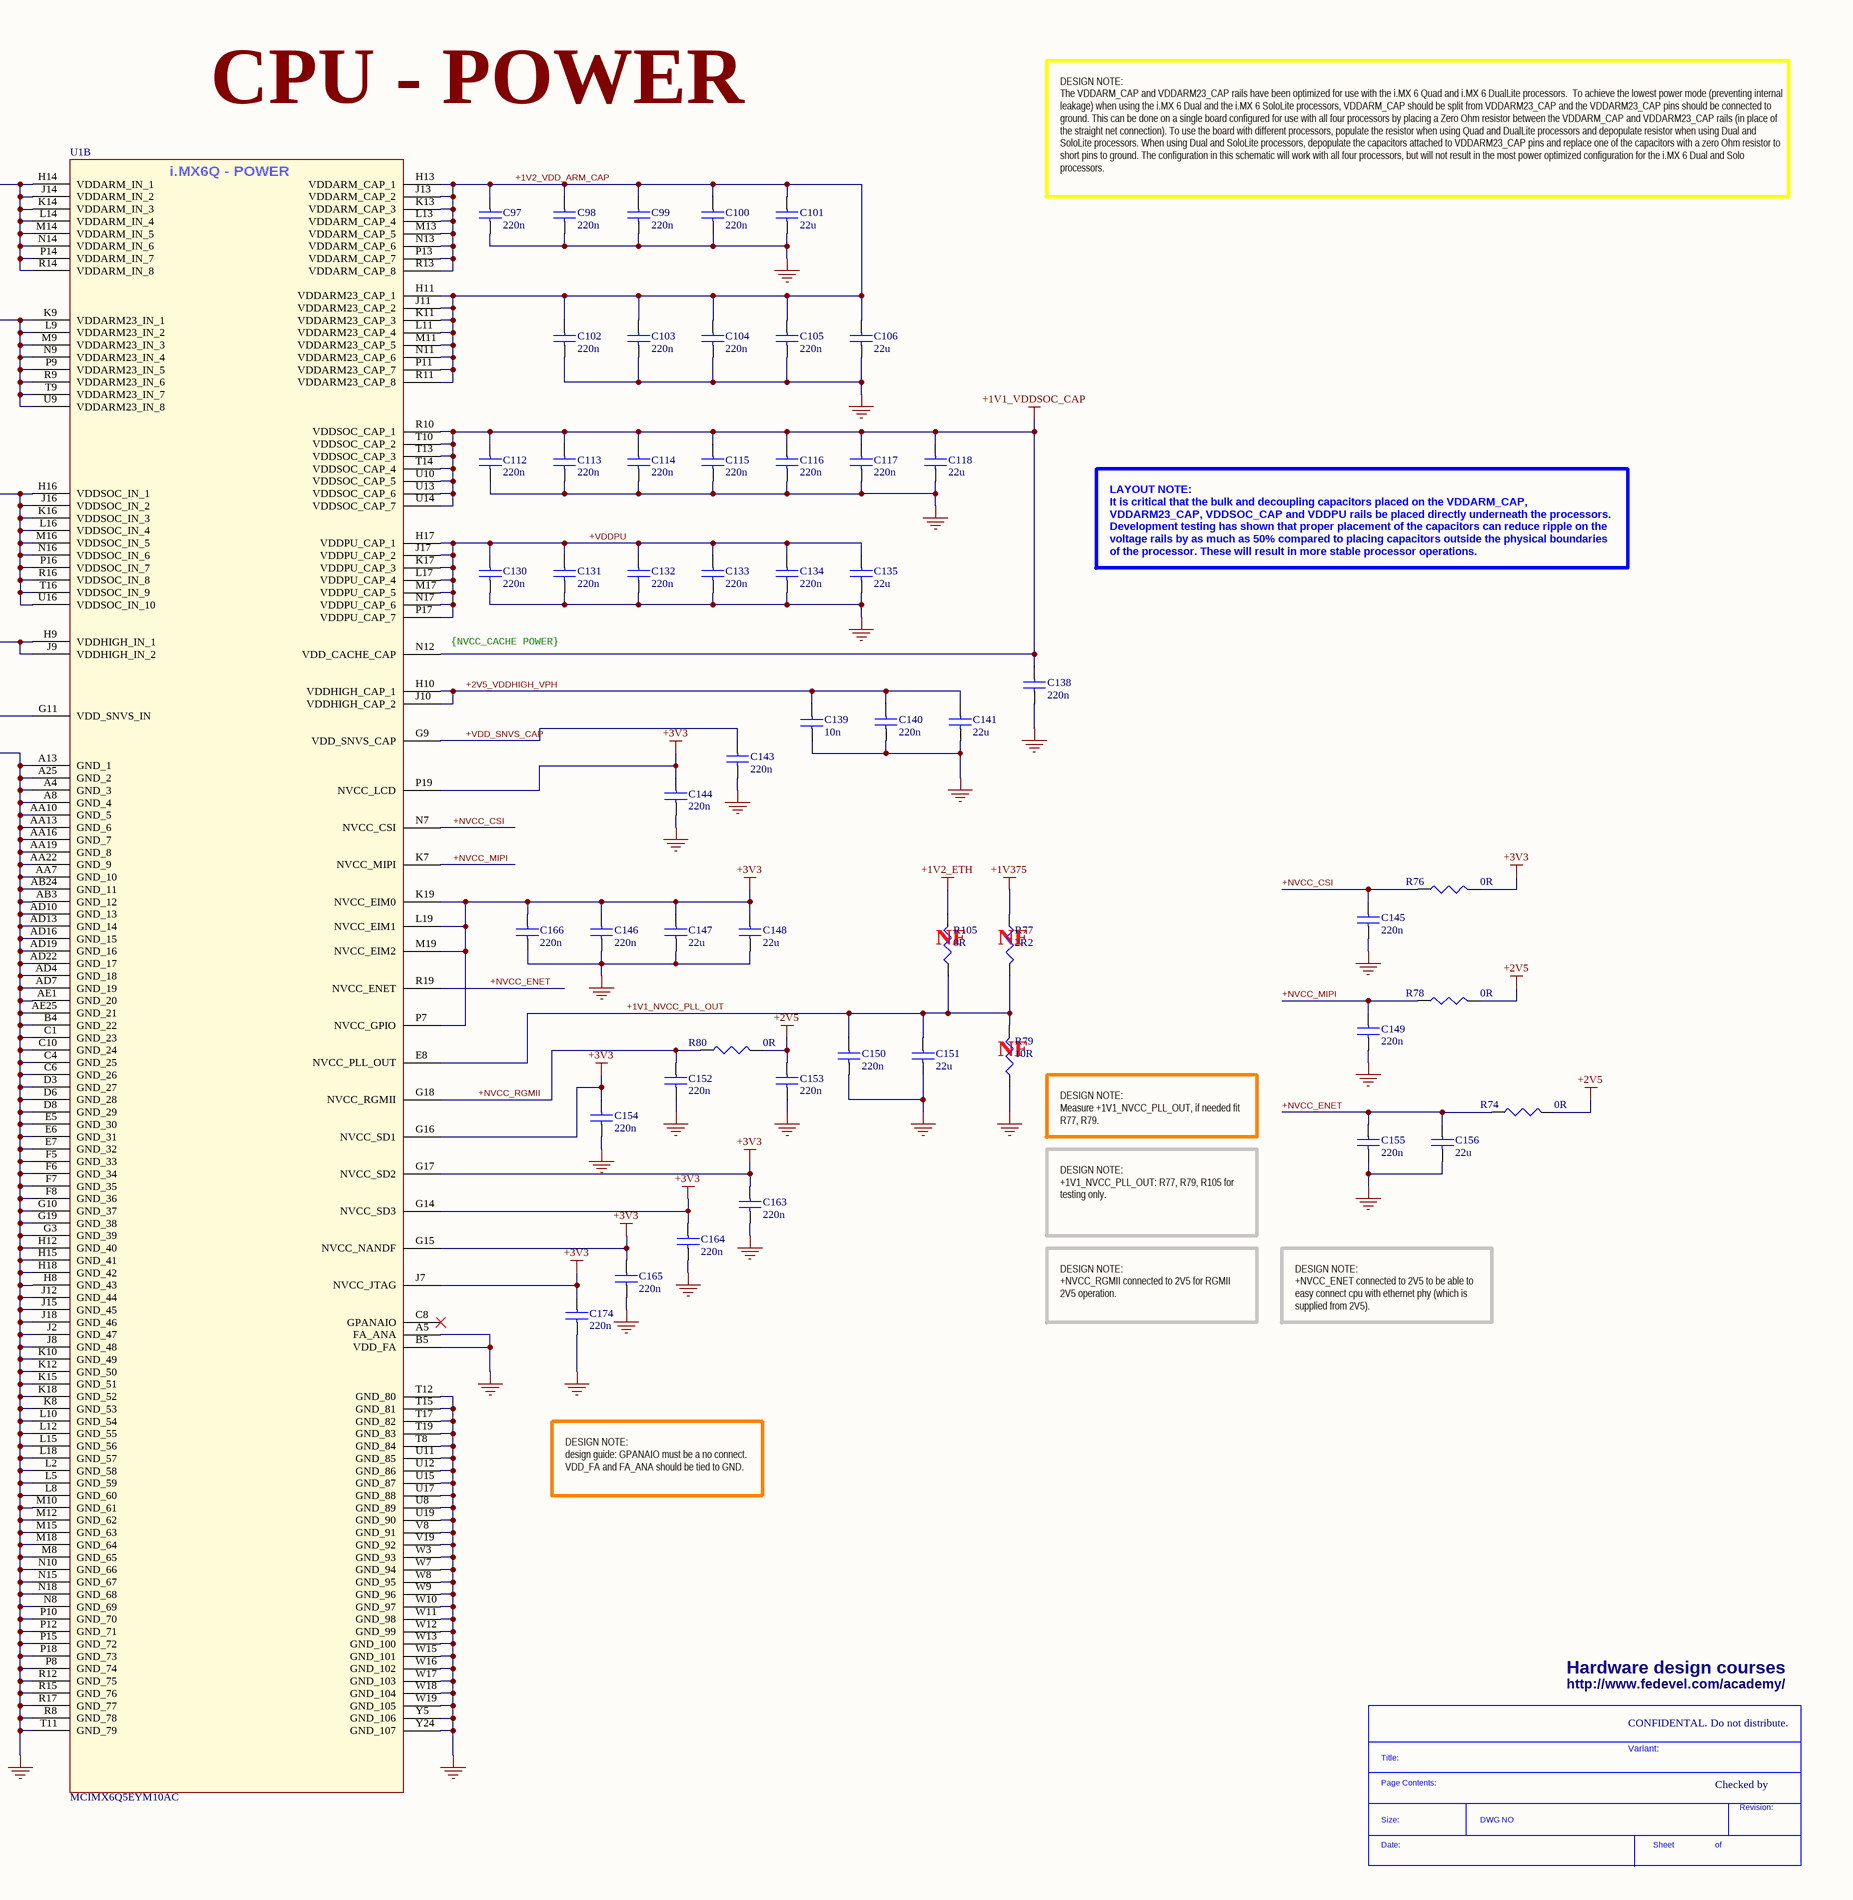
[diagram p3: [11] - CPU - POWER.SchDoc, right]

### Parts
(Parts that share a designator on the sheet are numbered #1, #2 ... from top to bottom, then left to right.)
*#2  SDTitleBlock  (value not drawn)  (graphical)
C90  220n  [C0402]
C91  220n  [C0402]
C92  220n  [C0402]
C93  220n  [C0402]
C94  220n  [C0402]
C95  220n  [C0402]
C96  22u  [C0603]
C97  220n  [C0402]
C98  220n  [C0402]
C99  220n  [C0402]
C100  220n  [C0402]
C101  22u  [C0603]
C102  220n  [C0402]
C103  220n  [C0402]
C104  220n  [C0402]
C105  220n  [C0402]
C106  22u  [C0603]
C107  220n  [C0402]
C108  220n  [C0402]
C109  220n  [C0402]
C110  220n  [C0402]
C111  22u  [C0603]
C112  220n  [C0402]
C113  220n  [C0402]
C114  220n  [C0402]
C115  220n  [C0402]
C116  220n  [C0402]
C117  220n  [C0402]
C118  22u  [C0603]
C119  220n  [C0402]
C120  220n  [C0402]
C121  220n  [C0402]
C122  220n  [C0402]
C123  220n  [C0402]
C124  220n  [C0402]
C125  220n  [C0402]
C126  220n  [C0402]
C127  22u  [C0603]
C128  22u  [C0603]
C129  22u  [C0603]
C130  220n  [C0402]
C131  220n  [C0402]
C132  220n  [C0402]
C133  220n  [C0402]
C134  220n  [C0402]
C135  22u  [C0603]
C136  220n  [C0402]
C137  22u  [C0805]
C138  220n  [C0402]
C139  10n  [C0402]
C140  220n  [C0402]
C141  22u  [C0805]
C142  220n  [C0402]
C143  220n  [C0402]
C144  220n  [C0402]
C145  220n  [C0402]
C146  220n  [C0402]
C147  22u  [C0805]
C148  22u  [C0805]
C149  220n  [C0402]
C150  220n  [C0402]
C151  22u  [C0603]
C152  220n  [C0402]
C153  220n  [C0402]
C154  220n  [C0402]
C155  220n  [C0402]
C156  22u  [C0805]
C157  220n  [C0402]
C158  220n  [C0402]
C159  220n  [C0402]
C160  220n  [C0402]
C161  220n  [C0402]
C162  220n  [C0402]
C163  220n  [C0402]
C164  220n  [C0402]
C165  220n  [C0402]
C166  220n  [C0402]
C167  220n  [C0402]
C168  220n  [C0402]
C169  220n  [C0402]
C170  220n  [C0402]
C171  220n  [C0402]
C172  22u  [C0603]
C173  22u  [C0603]
C174  220n  [C0402]
FB2  220R, 2.5A  [C0603]
R74  0R  [R0402]
R76  0R  [R0402]
R77  2R2  [R0402]
R78  0R  [R0402]
R79  10R  [R0402]
R80  0R  [R0402]
R105  0R  [R0402]
U1  MCIMX6Q5EYM10AC  [PBGA624]  (part B of 15)

### Nets
+1V1_VDDSOC_CAP: C112.1 C113.1 C114.1 C115.1 C116.1 C117.1 C118.1 C138.1 U1.N12(VDD_CACHE_CAP) U1.R10(VDDSOC_CAP_1) U1.T10(VDDSOC_CAP_2) U1.T13(VDDSOC_CAP_3) U1.T14(VDDSOC_CAP_4) U1.U10(VDDSOC_CAP_5) U1.U13(VDDSOC_CAP_6) U1.U14(VDDSOC_CAP_7)
+1V2_ETH: R105.2
+1V5_DDR: C157.1 C158.1 C159.1 C160.1 C161.1 C162.1 C167.1 C168.1 C169.1 C170.1 C171.1 C172.1 C173.1
+1V375: C90.1 C91.1 C92.1 C93.1 C94.1 C95.1 C96.1 C107.1 C108.1 C109.1 C110.1 C111.1 FB2.2 R77.1 U1.H14(VDDARM_IN_1) U1.J14(VDDARM_IN_2) U1.K9(VDDARM23_IN_1) U1.K14(VDDARM_IN_3) U1.L9(VDDARM23_IN_2) U1.L14(VDDARM_IN_4) U1.M9(VDDARM23_IN_3) U1.M14(VDDARM_IN_5) U1.N9(VDDARM23_IN_4) U1.N14(VDDARM_IN_6) U1.P9(VDDARM23_IN_5) U1.P14(VDDARM_IN_7) U1.R9(VDDARM23_IN_6) U1.R14(VDDARM_IN_8) U1.T9(VDDARM23_IN_7) U1.U9(VDDARM23_IN_8)
+2V5: C153.1 R74.2 R78.2 R80.2
+3V0_ALWAYS: C136.1 C137.1 C142.1 U1.G11(VDD_SNVS_IN) U1.H9(VDDHIGH_IN_1) U1.J9(VDDHIGH_IN_2)
+3V3: C144.1 C146.1 C147.1 C148.1 C154.1 C163.1 C164.1 C165.1 C166.1 C174.1 R76.2 U1.G14(NVCC_SD3) U1.G15(NVCC_NANDF) U1.G16(NVCC_SD1) U1.G17(NVCC_SD2) U1.J7(NVCC_JTAG) U1.K19(NVCC_EIM0) U1.L19(NVCC_EIM1) U1.M19(NVCC_EIM2) U1.P7(NVCC_GPIO) U1.P19(NVCC_LCD)
GND: C90.2 C91.2 C92.2 C93.2 C94.2 C95.2 C96.2 C97.2 C98.2 C99.2 C100.2 C101.2 C102.2 C103.2 C104.2 C105.2 C106.2 C107.2 C108.2 C109.2 C110.2 C111.2 C112.2 C113.2 C114.2 C115.2 C116.2 C117.2 C118.2 C119.2 C120.2 C121.2 C122.2 C123.2 C124.2 C125.2 C126.2 C127.2 C128.2 C129.2 C130.2 C131.2 C132.2 C133.2 C134.2 C135.2 C136.2 C137.2 C138.2 C139.1 C140.2 C141.2 C142.2 C143.2 C144.2 C145.2 C146.2 C147.2 C148.2 C149.2 C150.2 C151.2 C152.2 C153.2 C154.2 C155.2 C156.2 C157.2 C158.2 C159.2 C160.2 C161.2 C162.2 C163.2 C164.2 C165.2 C166.2 C167.2 C168.2 C169.2 C170.2 C171.2 C172.2 C173.2 C174.2 R79.1 U1.A4(GND_3) U1.A5(FA_ANA) U1.A8(GND_4) U1.A13(GND_1) U1.A25(GND_2) U1.AA7(GND_10) U1.AA10(GND_5) U1.AA13(GND_6) U1.AA16(GND_7) U1.AA19(GND_8) U1.AA22(GND_9) U1.AB3(GND_12) U1.AB24(GND_11) U1.AD4(GND_18) U1.AD7(GND_19) U1.AD10(GND_13) U1.AD13(GND_14) U1.AD16(GND_15) U1.AD19(GND_16) U1.AD22(GND_17) U1.AE1(GND_20) U1.AE25(GND_21) U1.B4(GND_22) U1.B5(VDD_FA) U1.C1(GND_23) U1.C4(GND_25) U1.C6(GND_26) U1.C10(GND_24) U1.D3(GND_27) U1.D6(GND_28) U1.D8(GND_29) U1.E5(GND_30) U1.E6(GND_31) U1.E7(GND_32) U1.F5(GND_33) U1.F6(GND_34) U1.F7(GND_35) U1.F8(GND_36) U1.G3(GND_39) U1.G10(GND_37) U1.G19(GND_38) U1.H8(GND_43) U1.H12(GND_40) U1.H15(GND_41) U1.H18(GND_42) U1.J2(GND_47) U1.J8(GND_48) U1.J12(GND_44) U1.J15(GND_45) U1.J18(GND_46) U1.K8(GND_53) U1.K10(GND_49) U1.K12(GND_50) U1.K15(GND_51) U1.K18(GND_52) U1.L2(GND_58) U1.L5(GND_59) U1.L8(GND_60) U1.L10(GND_54) U1.L12(GND_55) U1.L15(GND_56) U1.L18(GND_57) U1.M8(GND_65) U1.M10(GND_61) U1.M12(GND_62) U1.M15(GND_63) U1.M18(GND_64) U1.N8(GND_69) U1.N10(GND_66) U1.N15(GND_67) U1.N18(GND_68) U1.P8(GND_74) U1.P10(GND_70) U1.P12(GND_71) U1.P15(GND_72) U1.P18(GND_73) U1.R8(GND_78) U1.R12(GND_75) U1.R15(GND_76) U1.R17(GND_77) U1.T8(GND_84) U1.T11(GND_79) U1.T12(GND_80) U1.T15(GND_81) U1.T17(GND_82) U1.T19(GND_83) U1.U8(GND_89) U1.U11(GND_85) U1.U12(GND_86) U1.U15(GND_87) U1.U17(GND_88) U1.U19(GND_90) U1.V8(GND_91) U1.V19(GND_92) U1.W3(GND_93) U1.W7(GND_94) U1.W8(GND_95) U1.W9(GND_96) U1.W10(GND_97) U1.W11(GND_98) U1.W12(GND_99) U1.W13(GND_100) U1.W15(GND_101) U1.W16(GND_102) U1.W17(GND_103) U1.W18(GND_104) U1.W19(GND_105) U1.Y5(GND_106) U1.Y24(GND_107)
+1V1_NVCC_PLL_OUT: C150.1 C151.1 R77.2 R79.2 R105.1 U1.E8(NVCC_PLL_OUT)
+1V2_VDD_ARM_CAP: C97.1 C98.1 C99.1 C100.1 C101.1 C102.1 C103.1 C104.1 C105.1 C106.1 U1.H11(VDDARM23_CAP_1) U1.H13(VDDARM_CAP_1) U1.J11(VDDARM23_CAP_2) U1.J13(VDDARM_CAP_2) U1.K11(VDDARM23_CAP_3) U1.K13(VDDARM_CAP_3) U1.L11(VDDARM23_CAP_4) U1.L13(VDDARM_CAP_4) U1.M11(VDDARM23_CAP_5) U1.M13(VDDARM_CAP_5) U1.N11(VDDARM23_CAP_6) U1.N13(VDDARM_CAP_6) U1.P11(VDDARM23_CAP_7) U1.P13(VDDARM_CAP_7) U1.R11(VDDARM23_CAP_8) U1.R13(VDDARM_CAP_8)
+1V375_VDDSOC_IN: C119.1 C120.1 C121.1 C122.1 C123.1 C124.1 C125.1 C126.1 C127.1 C128.1 C129.1 FB2.1 U1.H16(VDDSOC_IN_1) U1.J16(VDDSOC_IN_2) U1.K16(VDDSOC_IN_3) U1.L16(VDDSOC_IN_4) U1.M16(VDDSOC_IN_5) U1.N16(VDDSOC_IN_6) U1.P16(VDDSOC_IN_7) U1.R16(VDDSOC_IN_8) U1.T16(VDDSOC_IN_9) U1.U16(VDDSOC_IN_10)
+2V5_VDDHIGH_VPH: C139.2 C140.1 C141.1 U1.H10(VDDHIGH_CAP_1) U1.J10(VDDHIGH_CAP_2)
+NVCC_CSI: C145.1 R76.1 U1.N7(NVCC_CSI)
+NVCC_ENET: C155.1 C156.1 R74.1 U1.R19(NVCC_ENET)
+NVCC_MIPI: C149.1 R78.1 U1.K7(NVCC_MIPI)
+NVCC_RGMII: C152.1 R80.1 U1.G18(NVCC_RGMII)
+VDD_SNVS_CAP: C143.1 U1.G9(VDD_SNVS_CAP)
+VDDPU: C130.1 C131.1 C132.1 C133.1 C134.1 C135.1 U1.H17(VDDPU_CAP_1) U1.J17(VDDPU_CAP_2) U1.K17(VDDPU_CAP_3) U1.L17(VDDPU_CAP_4) U1.M17(VDDPU_CAP_5) U1.N17(VDDPU_CAP_6) U1.P17(VDDPU_CAP_7)

Not connected (* = marked no-connect by the designer): U1 C8(GPANAIO)*

### Notes on the sheet
- CPU - POWER
- 2500mA (max 3920mA)
- DESIGN NOTE:
  Disable LDOs for VDDARM_IN, VDDARM23_IN and VDDSOC_IN.
- DESIGN NOTE:
  For testing purpuse only: Set +1V375 to +1.24V (when LDO VDDARM, VDDARM23 and VDDSOC are disabled) to lower power dissipation.
- DESIGN NOTE:
  The VDDARM_CAP and VDDARM23_CAP rails have been optimized for use with the i.MX 6 Quad and i.MX 6 DualLite processors.  To achieve the lowest power mode (preventing internal leakage) when using the i.MX 6 Dual and the i.MX 6 SoloLite processors, VDDARM_CAP should be split from VDDARM23_CAP and the VDDARM23_CAP pins should be connected to ground. This can be done on a single board configured for use with all four processors by placing a Zero Ohm resistor between the VDDARM_CAP and VDDARM23_CAP rails (in place of the straight net connection). To use the board with different processors, populate the resistor when using Quad and DualLite processors and depopulate resistor when using Dual and SoloLite processors. When using Dual and SoloLite processors, depopulate the capacitors attached to VDDARM23_CAP pins and replace one of the capacitors with a zero Ohm resistor to short pins to ground. The configuration in this schematic will work with all four processors, but will not result in the most power optimized configuration for the i.MX 6 Dual and Solo processors.
- 1750mA (max 1890mA)
- LAYOUT NOTE:
  It is critical that the bulk and decoupling capacitors placed on the VDDARM_CAP, VDDARM23_CAP, VDDSOC_CAP and VDDPU rails be placed directly underneath the processors. Development testing has shown that proper placement of the capacitors can reduce ripple on the voltage rails by as much as 50% compared to placing capacitors outside the physical boundaries of the processor. These will result in more stable processor operations.
- 100mA (max 125mA)
- {NVCC_CACHE POWER}
- (near R105) NF
- (near R77) NF
- (near R79) NF
- MX6 power domains under-BGA decoupling (belongs to CPU pins on page 4)
- DESIGN NOTE:
  Measure +1V1_NVCC_PLL_OUT, if needed fit R77, R79.
- DESIGN NOTE:
  +1V1_NVCC_PLL_OUT: R77, R79, R105 for testing only.
- DESIGN NOTE:
  +NVCC_RGMII connected to 2V5 for RGMII 2V5 operation.
- DESIGN NOTE:
  +NVCC_ENET connected to 2V5 to be able to easy connect cpu with ethernet phy (which is supplied from 2V5).
- DESIGN NOTE:
  design guide: GPANAIO must be a no connect. VDD_FA and FA_ANA should be tied to GND.
- Hardware design courses
- http://www.fedevel.com/academy/
- CONFIDENTAL. Do not distribute.
- Variant:
- Checked by
- (in symbol MCIMX6Q5EYM10AC, part B) i.MX6Q - POWER
- (in symbol SDTitleBlock) Title:; Page Contents:; Revision:; Size:; DWG NO; Date:; Sheet; of

### Library data of the parts
C90-C95 C97-C100 C102-C105 C107-C110 C112-C117 C119-C126 C130-C134 C136 C138 C140 C142-C146 C149 C150 C152-C155 C157-C171 C174 = C1005X5R1E224M: as C3 on sheet [04] - CPU - DDR3, DDR3 MEM; Category: Capacitors; Supplier Part Number: 445-5945-1-ND; Manufacturer Part Number: C1005X5R1E224M; Operating Temperature: -55°C ~ 85°C; Package / Case: 0402 (1005 Metric); Price 1k [$]: 0.02600; .Checked SCH: used; Voltage - Rated: 25V; Supplier: Digikey; Supplier 1: Digi-Key; Supplier Part Number 1: 445-5945-1-ND; RoHS: RoHS Compliant; Stock 1: 54593; Pricing 1: 1=0.3, 10=0.2, 100=0.08, 250=0.05752, 500=0.041, 1000=0.03 (USD); Tolerance: ±20%; Temperature Coefficient: X5R; Mounting Type: Surface Mount, MLCC; Applications: General Purpose; Ratings: -; Size / Dimension: 0.039" L x 0.020" W (1.00mm x 0.50mm); Height - Seated (Max): -; Thickness (Max): 0.022" (0.55mm); Lead Spacing: -; Features: -; Packaging: Cut Tape (CT); Lead Style: -; ComponentLink1URL: http://www.tdk.co.jp/tefe02/e412_c.pdf; ComponentLink1Description: http://www.tdk.co.jp/tefe02/e412_c.pdf
C96 C101 C106 C111 C118 C127-C129 C135 C151 C172 C173 = GRM188R60G226MEA0L: as C12 on sheet [04] - CPU - DDR3, DDR3 MEM; Supplier 1: Digi-Key; Supplier Part Number 1: 490-5526-1-ND; Manufacturer Part Number: GRM188R60G226MEA0L; RoHS: RoHS Compliant; Category: Capacitors; Stock 1: 5760; Pricing 1: 1=0.79, 10=0.663, 50=0.4752, 100=0.4158, 250=0.32672, 500=0.297, 1000=0.2376 (USD); Voltage - Rated: 4V; Tolerance: ±20%; Temperature Coefficient: X5R; Mounting Type: Surface Mount, MLCC; Operating Temperature: -55°C ~ 85°C; Applications: General Purpose; Ratings: -; Package / Case: 0603 (1608 Metric); Size / Dimension: 0.063" L x 0.031" W (1.60mm x 0.80mm); Height - Seated (Max): -; Thickness (Max): 0.035" (0.90mm); Lead Spacing: -; Features: -; Packaging: Cut Tape (CT); Lead Style: -; ComponentLink1URL: http://www.murata.com/products/catalog/pdf/c02e.pdf; ComponentLink1Description: http://www.murata.com/products/catalog/pdf/c02e.pdf
C137 C141 C147 C148 C156 = C2012X5R1C226K: CAP CER 22UF 16V 10% X5R 0805; Manufacturer: TDK Corporation; Capacitance: 22µF; .Checked PCB: RF; Supplier 1: Digi-Key; Supplier Part Number 1: 445-6797-1-ND; Manufacturer Part Number: C2012X5R1C226K; RoHS: RoHS Compliant; Category: Capacitors; Stock 1: 15408; Pricing 1: 1=0.77, 10=0.737, 100=0.3575, 250=0.297, 500=0.2695, 1000=0.2475 (USD); Voltage - Rated: 16V; Tolerance: ±10%; Temperature Coefficient: X5R; Mounting Type: Surface Mount, MLCC; Operating Temperature: -55°C ~ 85°C; Applications: General Purpose; Ratings: -; Package / Case: 0805 (2012 Metric); Size / Dimension: 0.079" L x 0.049" W (2.00mm x 1.25mm); Height - Seated (Max): -; Thickness (Max): 0.057" (1.45mm); Lead Spacing: -; Features: -; Packaging: Cut Tape (CT); Lead Style: -; ComponentLink1URL: http://www.tdk.com/pdf/general_B11.pdf; ComponentLink1Description: http://www.tdk.com/pdf/general_B11.pdf; .Checked SCH: RF
C139 = C1005X7R1C103K: CAP CER 10000PF 16V X7R 10% 0402; Manufacturer: TDK Corporation; Value: 10nF; .Checked PCB: used; Capacitance: 10000pF; Category: Capacitors; Supplier Part Number: 445-1262-1-ND; Manufacturer Part Number: C1005X7R1C103K; Operating Temperature: -55°C ~ 125°C; Package / Case: 0402 (1005 Metric); Price 1k [$]: 0.00416; .Checked SCH: used; Voltage - Rated: 16V; Supplier: Digikey; Supplier 1: Digi-Key; Supplier Part Number 1: 445-1262-1-ND; RoHS: RoHS Compliant; Stock 1: 511497; Pricing 1: 1=0.08, 10=0.05, 100=0.018, 250=0.013, 500=0.0096, 1000=0.0065 (USD); Tolerance: ±10%; Temperature Coefficient: X7R; Mounting Type: Surface Mount, MLCC; Applications: General Purpose; Ratings: -; Size / Dimension: 0.039" L x 0.020" W (1.00mm x 0.50mm); Height - Seated (Max): -; Thickness (Max): 0.022" (0.55mm); Lead Spacing: -; Features: -; Packaging: Cut Tape (CT); Lead Style: -; ComponentLink1URL: http://www.tdk.co.jp/tefe02/e412_c.pdf; ComponentLink1Description: http://www.tdk.co.jp/tefe02/e412_c.pdf
FB2 = BLM18SG221TN1D: FERRITE CHIP 220 OHM 2500MA 0603; Manufacturer: Murata Electronics North America; Impedance @ Frequency: 220 Ohm @ 100MHz; DC Resistance (DCR): 40 mOhm Max; Filter Type: Differential Mode - Single; Number of Lines: 1; .Checked PCB: RF; Supplier 1: Digi-Key; Supplier Part Number 1: 490-5225-1-ND; Manufacturer Part Number: BLM18SG221TN1D; RoHS: RoHS Compliant; Category: Filters; Stock 1: 54640; Pricing 1: 1=0.38, 10=0.282, 50=0.1646, 100=0.1316, 250=0.094, 500=0.06392, 1000=0.0517, 5000=0.04042 (USD); Current Rating: 2.5A; Package / Case: 0603 (1608 Metric); Mounting Type: Surface Mount; Packaging: Cut Tape (CT); Height (Max): 0.037" (0.95mm); Size / Dimension: 0.063" L x 0.031" W (1.60mm x 0.80mm); ComponentLink1URL: http://search.murata.co.jp/Ceramy/image/img/PDF/ENG/L0110S0100BLM18S.pdf; ComponentLink1Description: http://search.murata.co.jp/Ceramy/image/img/PDF/ENG/L0110S0100BLM18S.pdf; .Checked SCH: RF
R74 R76 R78 R80 R105 = RC0402JR-070RL: RES 0.0 OHM 1/16W 0402 SMD; Manufacturer: Yageo; Resistance (Ohms): 0.0; Power (Watts): 0.063W, 1/16W; Tolerance: Jumper; .Checked PCB: used; Category: Resistors; Supplier Part Number: 311-0.0JRCT-ND; Manufacturer Part Number: RC0402JR-070RL; Package / Case: 0402 (1005 Metric); Price 1k [$]: 0.01389; Value: 0R; .Checked SCH: used; Supplier: Digikey; Supplier 1: Digi-Key; Supplier Part Number 1: 311-0.0JRCT-ND; RoHS: RoHS Compliant; Stock 1: 1106330; Pricing 1: 10=0.012, 50=0.009, 100=0.0069, 250=0.00512, 500=0.0038, 1000=0.00253 (USD); Composition: Thick Film; Features: -; Temperature Coefficient: -; Size / Dimension: 0.039" L x 0.020" W (1.00mm x 0.50mm); Height: 0.016" (0.40mm); Number of Terminations: 2; Packaging: Cut Tape (CT); ComponentLink1URL: http://www.yageo.com/documents/recent/PYu-RC0402_51_RoHS_L_6.pdf; ComponentLink1Description: http://www.yageo.com/documents/recent/PYu-RC0402_51_RoHS_L_6.pdf
R77 = CRCW04022R20FKED: RES 2.20 OHM 1/16W 1% 0402 SMD; Manufacturer: Vishay Dale; Resistance (Ohms): 2.2; Power (Watts): 0.063W, 1/16W; Temperature Coefficient: ±100ppm/°C; .Checked PCB: RF; Supplier 1: Digi-Key; Supplier Part Number 1: 541-2.20LLCT-ND; Manufacturer Part Number: CRCW04022R20FKED; RoHS: RoHS Compliant; Category: Resistors; Stock 1: 10205; Pricing 1: 10=0.083, 50=0.0444, 200=0.0255, 1000=0.0174 (USD); Composition: Thick Film; Features: -; Tolerance: ±1%; Package / Case: 0402 (1005 Metric); Size / Dimension: 0.039" L x 0.020" W (1.00mm x 0.50mm); Height: 0.016" (0.40mm); Number of Terminations: 2; Packaging: Cut Tape (CT); ComponentLink1URL: http://www.vishay.com/docs/20035/dcrcwe3.pdf; ComponentLink1Description: http://www.vishay.com/docs/20035/dcrcwe3.pdf; .Checked SCH: RF
R79 = RC0402FR-0710RL: RES 10.0 OHM 1/16W 1% 0402 SMD; Manufacturer: Yageo; Resistance (Ohms): 10; Power (Watts): 0.063W, 1/16W; .Checked PCB: used; Temperature Coefficient: ±200ppm/°C; Category: Resistors; Supplier Part Number: 311-10.0LRCT-ND; Manufacturer Part Number: RC0402FR-0710RL; Package / Case: 0402 (1005 Metric); Price 1k [$]: 0.01421; Tolerance: ±1%; Value: 10R; .Checked SCH: used; Supplier: Digikey; Supplier 1: Digi-Key; Supplier Part Number 1: 311-10.0LRCT-ND; RoHS: RoHS Compliant; Stock 1: 681416; Pricing 1: 10=0.014, 50=0.0104, 100=0.0079, 250=0.00584, 500=0.00432, 1000=0.00288 (USD); Composition: Thick Film; Features: -; Size / Dimension: 0.039" L x 0.020" W (1.00mm x 0.50mm); Height: 0.016" (0.40mm); Number of Terminations: 2; Packaging: Cut Tape (CT); ComponentLink1URL: http://www.yageo.com/documents/recent/PYu-RC0402_51_RoHS_L_6.pdf; ComponentLink1Description: http://www.yageo.com/documents/recent/PYu-RC0402_51_RoHS_L_6.pdf
U1 = MCIMX6Q5EYM10AC: as U1 on sheet [04] - CPU - DDR3, DDR3 MEM; Supplier 1: Digi-Key; Manufacturer Part Number: MCIMX6Q5EYM10AC; RoHS: RoHS Compliant; Category: Integrated Circuits (ICs); Stock 1: 0; Pricing 1: 1=54.98, 10=51.922, 25=48.868, 100=30.5424 (USD); Program Memory Size: -; EEPROM Size: -; Data Converters: -; Operating Temperature: -20°C ~ 105°C; Package / Case: 624-FBGA, FCBGA; Packaging: Tray; ComponentLink1URL: http://cache.freescale.com/files/32bit/doc/data_sheet/IMX6DQCEC.pdf; ComponentLink1Description: http://cache.freescale.com/files/32bit/doc/data_sheet/IMX6DQCEC.pdf; Supplier Part Number 1: MCIMX6Q5EYM10AC-ND; .Checked SCH: MM

## Nets that join several sheets
+1V5_DDR: [04] - CPU - DDR3, DDR3 MEM (134 pins), [11] - CPU - POWER (13 pins)
GND: [04] - CPU - DDR3, DDR3 MEM (149 pins), [11] - CPU - POWER (195 pins)

## Assembly variants
Prototype: not fitted FB8 Q5 Q8 Q9 R24 R51 R53 R54 R58 R65 R71 R77 R79 R87 R103 R105 R111 R117 R118 R120 R131 R133 R135 R137 R141 R142 R155 R156 R157